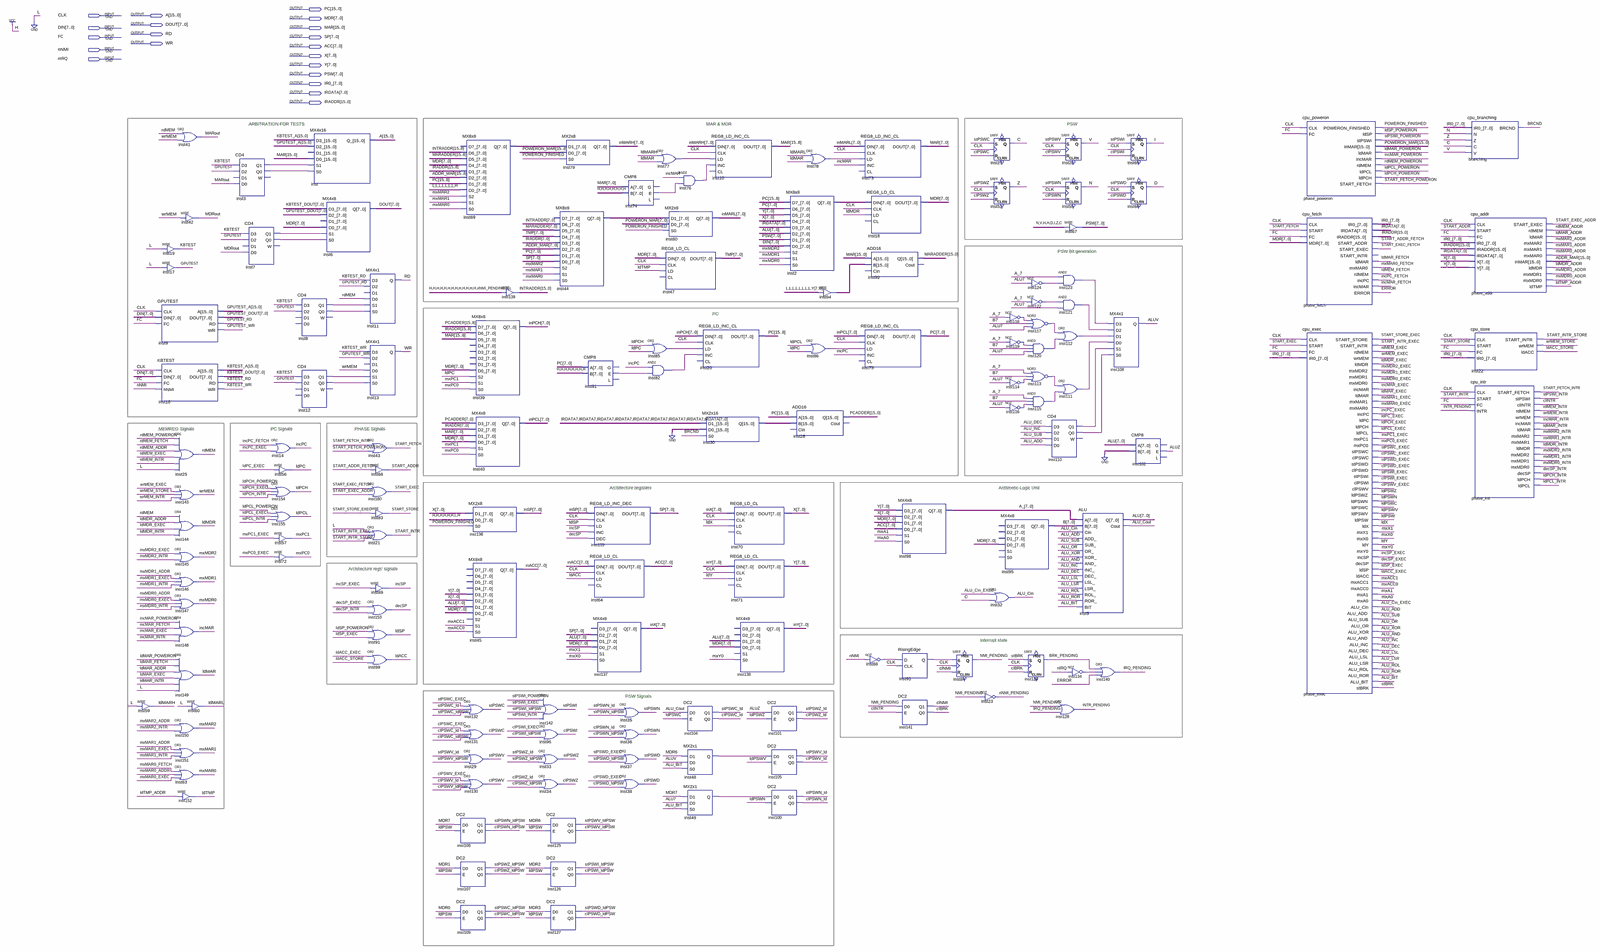
[diagram p0: schematic sheet, whole]
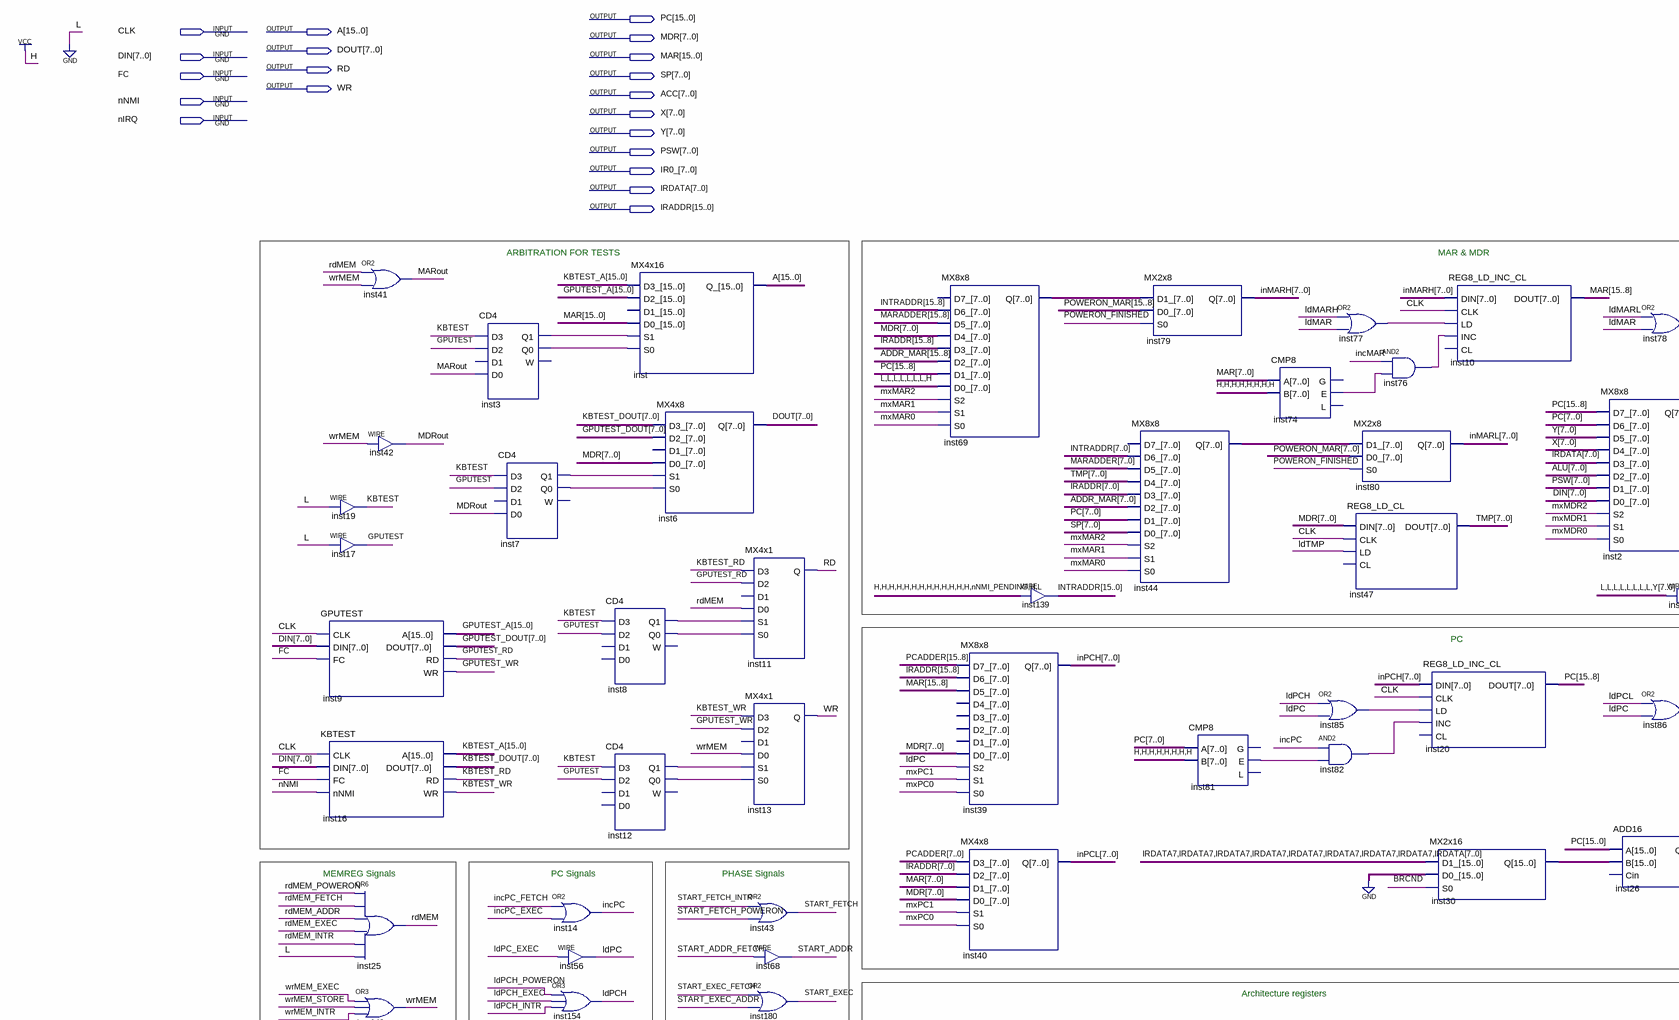
[diagram p1: schematic sheet, upper left part]
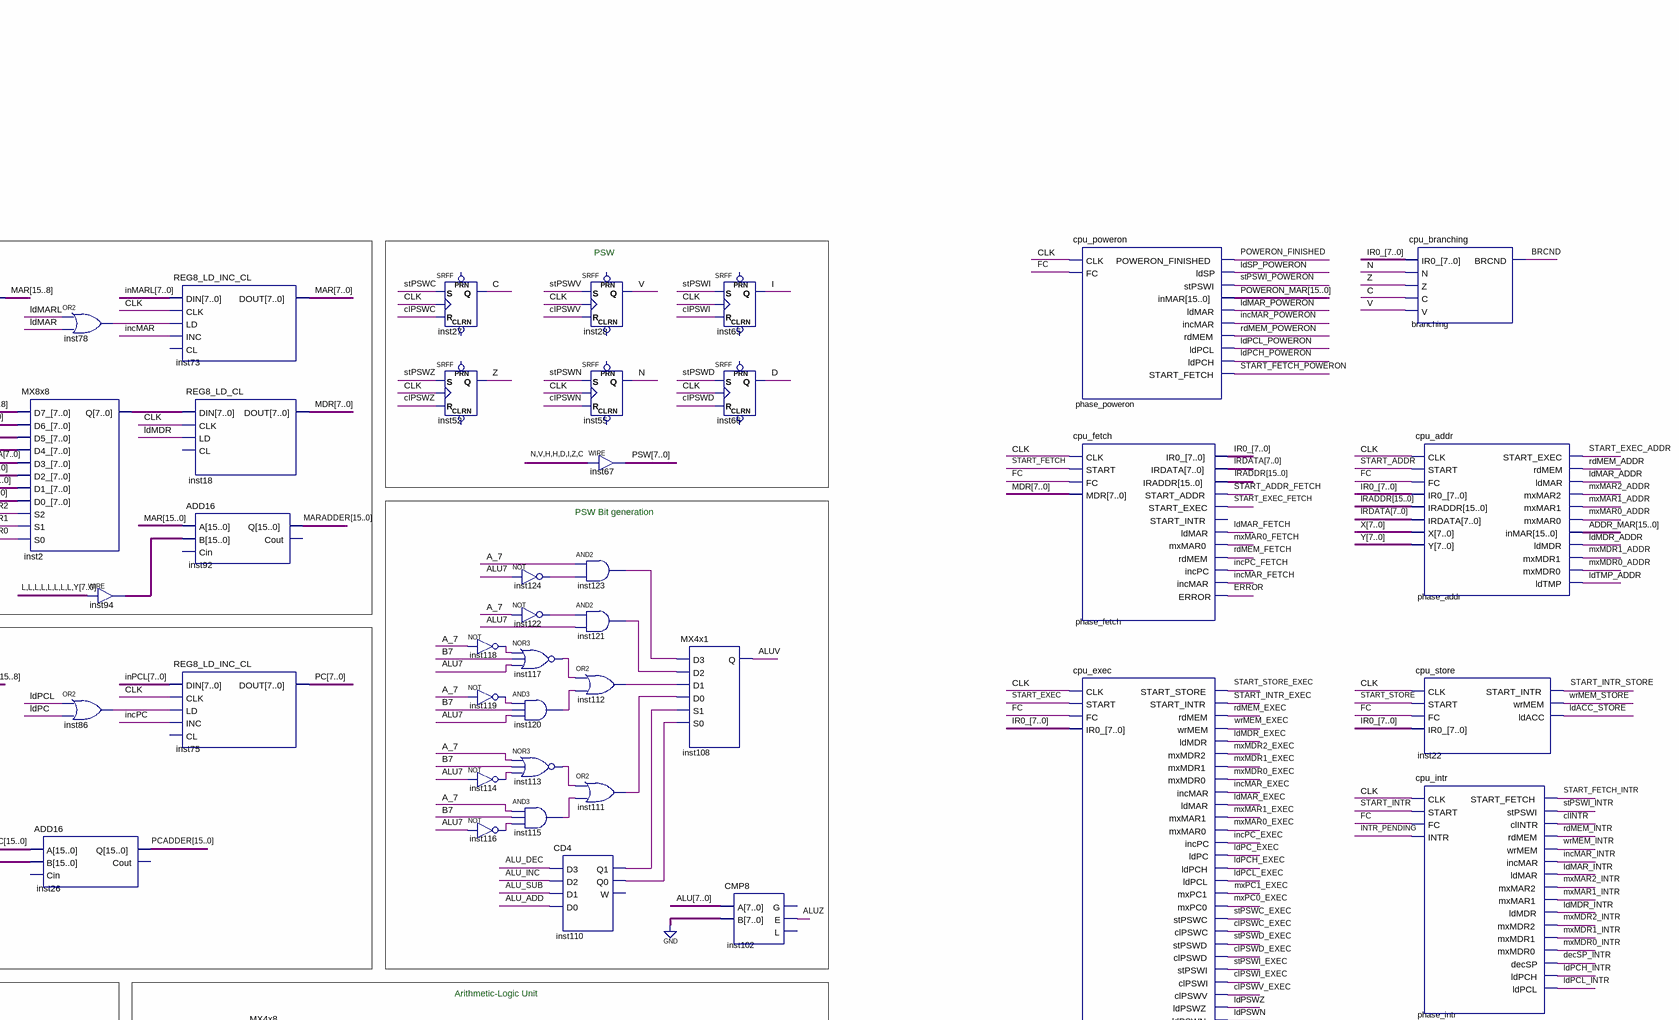
[diagram p2: schematic sheet, upper right part]
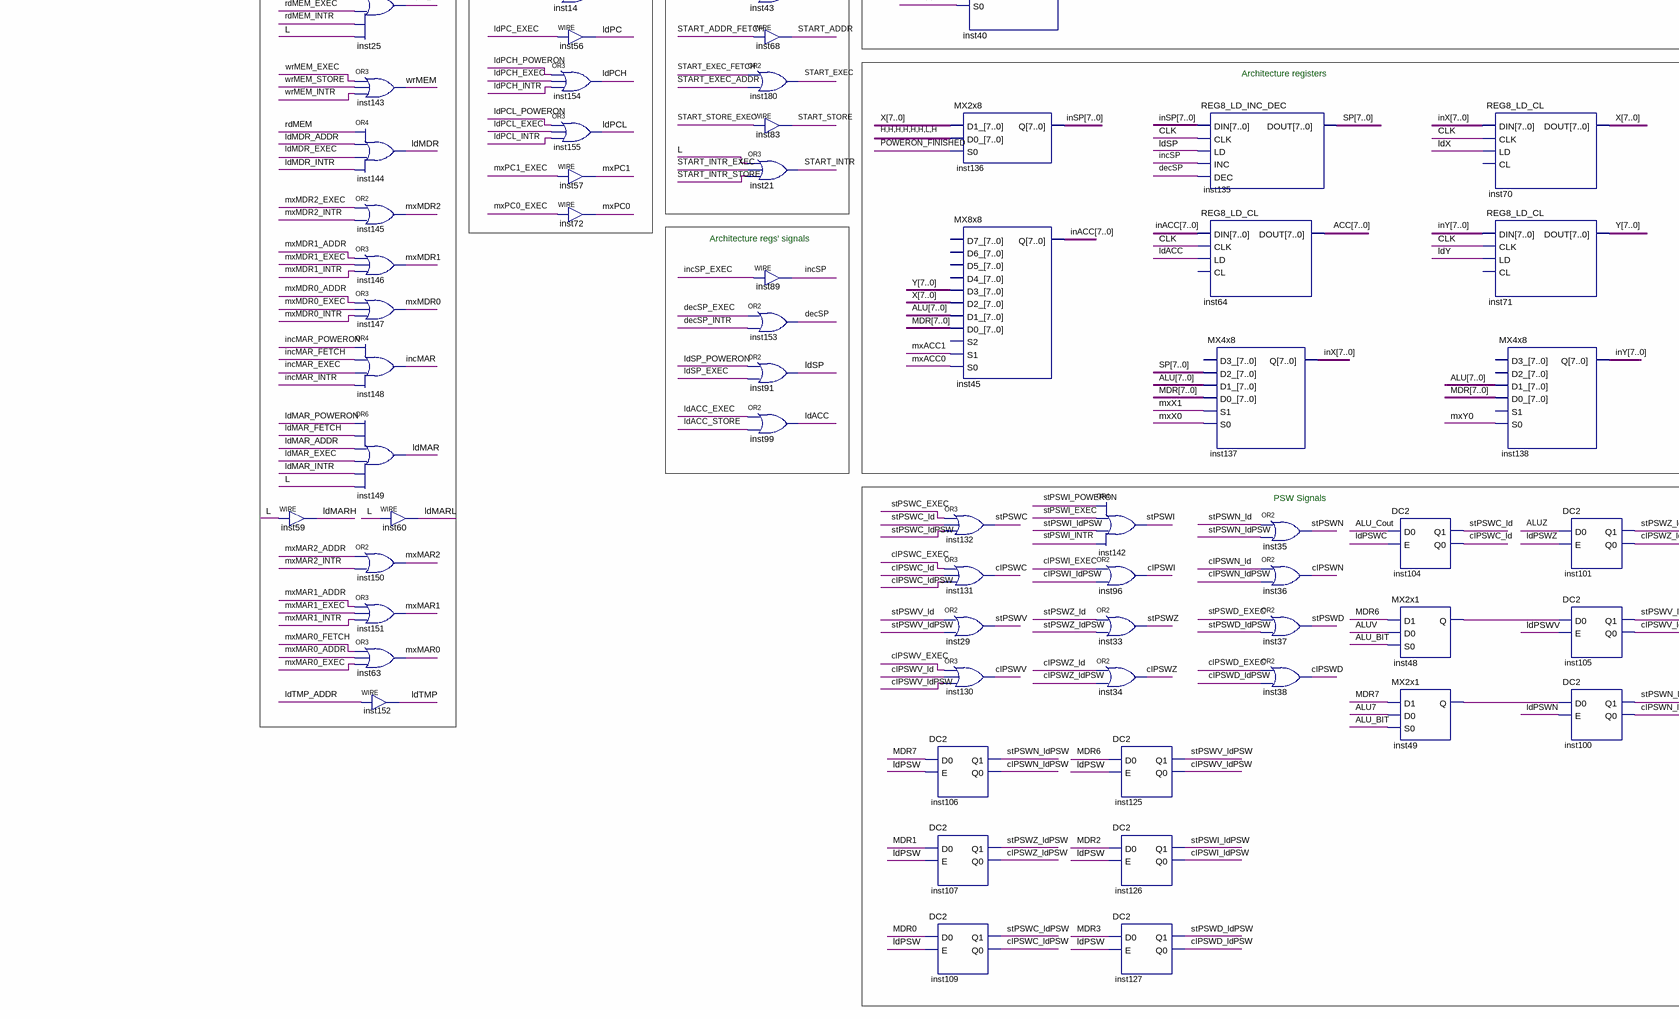
[diagram p3: schematic sheet, lower left part]
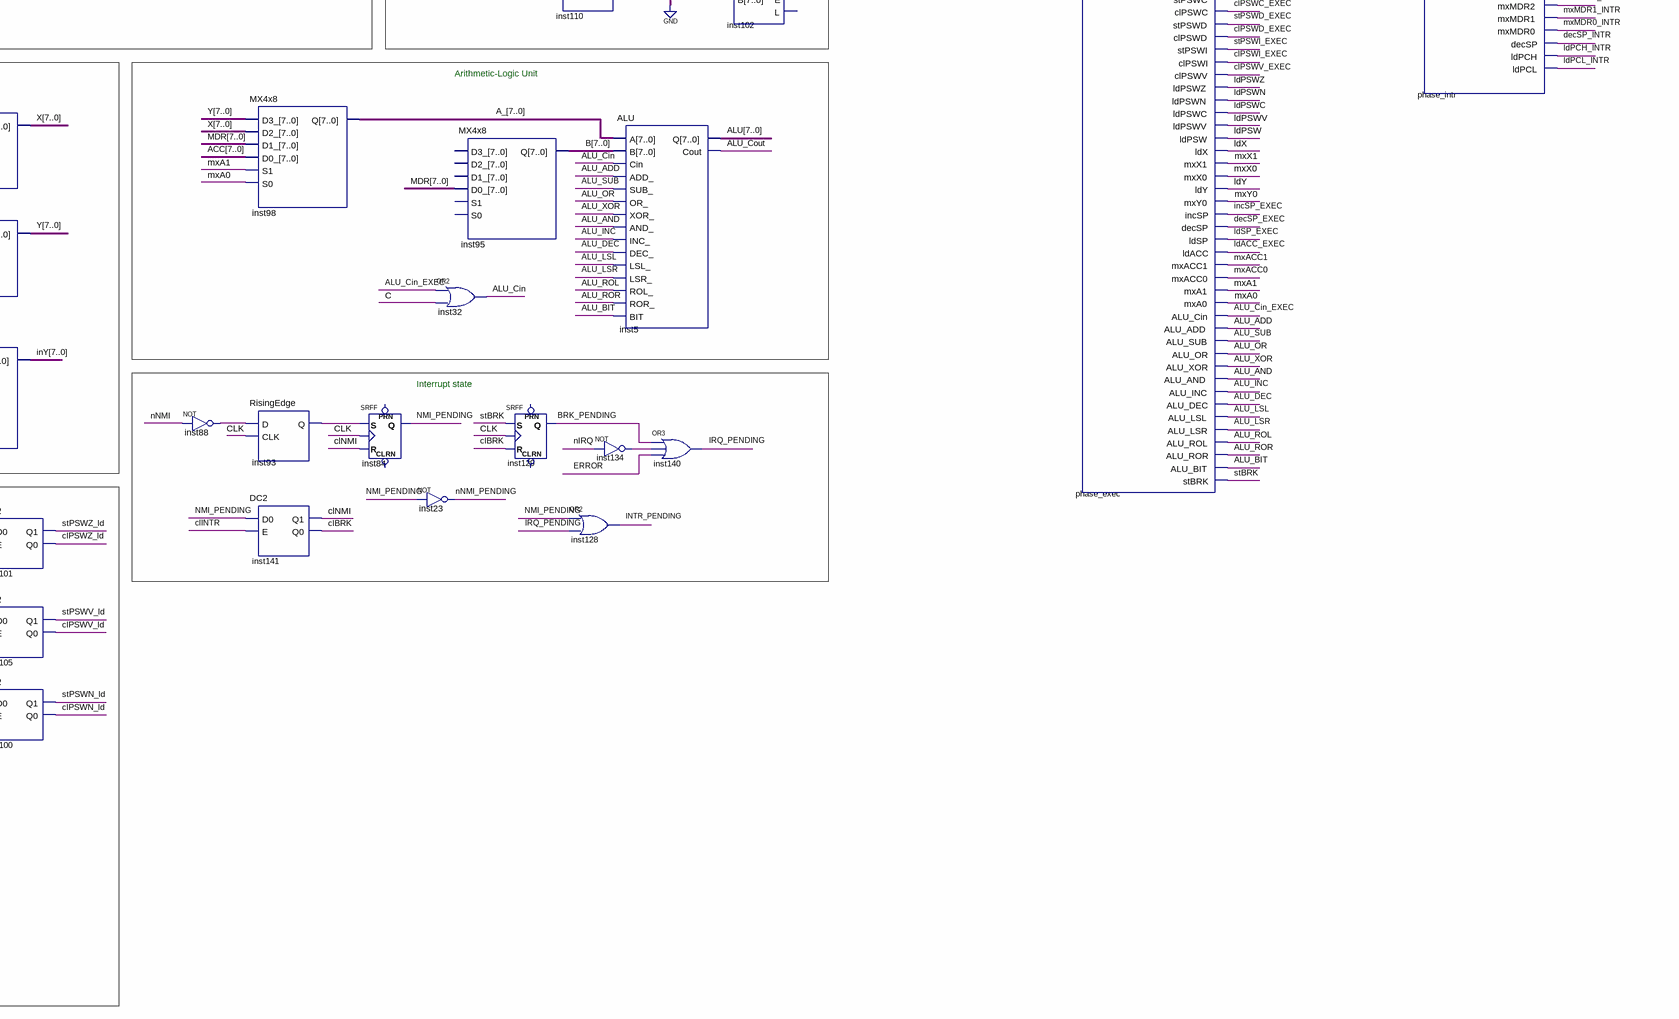
[diagram p4: schematic sheet, lower right part]
// Quartus schematic cpu.bdf as structural Verilog: 145 symbols, 20 pins
module cpu (
  input  CLK,
  input  [7:0] DIN,
  input  FC,
  input  nNMI,
  input  nIRQ,
  output [15:0] PC,
  output [15:0] A,
  output [7:0] MDR,
  output [7:0] DOUT,
  output [15:0] MAR,
  output RD,
  output [7:0] SP,
  output WR,
  output [7:0] ACC,
  output [7:0] X,
  output [7:0] Y,
  output [7:0] PSW,
  output [7:0] IR0_,
  output [7:0] IRDATA,
  output [15:0] IRADDR
);

  wire ALU_ADD, ALU_AND, ALU_BIT, ALU_Cin, ALU_Cin_EXEC, ALU_Cout, ALU_DEC, ALU_INC, ALU_LSL, ALU_LSR,
       ALU_OR, ALU_ROL, ALU_ROR, ALU_SUB, ALU_XOR, ALUV, ALUZ, BRCND, BRK_PENDING, C, clBRK, clINTR, clNMI,
       clPSWC, clPSWC_EXEC, clPSWC_ld, clPSWC_ldPSW, clPSWD, clPSWD_EXEC, clPSWD_ldPSW, clPSWI, clPSWI_EXEC,
       clPSWI_ldPSW, clPSWN, clPSWN_ld, clPSWN_ldPSW, clPSWV, clPSWV_EXEC, clPSWV_ld, clPSWV_ldPSW, clPSWZ,
       clPSWZ_ld, clPSWZ_ldPSW, D, decSP, decSP_EXEC, decSP_INTR, ERROR, GPUTEST, GPUTEST_RD, GPUTEST_WR, I,
       incMAR, incMAR_EXEC, incMAR_FETCH, incMAR_INTR, incMAR_POWERON, incPC, incPC_EXEC, incPC_FETCH, incSP,
       incSP_EXEC, inst3_q0, inst3_q1, inst7_q0, inst7_q1, inst8_q0, inst8_q1, inst12_q0, inst12_q1,
       inst48_q, inst49_q, inst74_e, inst76_out, inst77_out, inst78_out, inst81_e, inst82_out, inst85_out,
       inst86_out, inst88_out, inst93_q, inst110_q0, inst110_q1, inst111_out, inst112_out, inst113_out,
       inst114_out, inst115_out, inst116_out, inst117_out, inst118_out, inst119_out, inst120_out,
       inst121_out, inst122_out, inst123_out, inst124_out, inst134_out, INTR_PENDING, IRQ_PENDING, KBTEST,
       KBTEST_RD, KBTEST_WR, ldACC, ldACC_EXEC, ldACC_STORE, ldMAR, ldMAR_ADDR, ldMAR_EXEC, ldMAR_FETCH,
       ldMAR_INTR, ldMAR_POWERON, ldMARH, ldMARL, ldMDR, ldMDR_ADDR, ldMDR_EXEC, ldMDR_INTR, ldPC, ldPC_EXEC,
       ldPCH, ldPCH_EXEC, ldPCH_INTR, ldPCH_POWERON, ldPCL, ldPCL_EXEC, ldPCL_INTR, ldPCL_POWERON, ldPSW,
       ldPSWC, ldPSWN, ldPSWV, ldPSWZ, ldSP, ldSP_EXEC, ldSP_POWERON, ldTMP, ldTMP_ADDR, ldX, ldY, MARout,
       MDRout, mxA0, mxA1, mxACC0, mxACC1, mxMAR0, mxMAR0_ADDR, mxMAR0_EXEC, mxMAR0_FETCH, mxMAR1,
       mxMAR1_ADDR, mxMAR1_EXEC, mxMAR1_INTR, mxMAR2, mxMAR2_ADDR, mxMAR2_INTR, mxMDR0, mxMDR0_ADDR,
       mxMDR0_EXEC, mxMDR0_INTR, mxMDR1, mxMDR1_ADDR, mxMDR1_EXEC, mxMDR1_INTR, mxMDR2, mxMDR2_EXEC,
       mxMDR2_INTR, mxPC0, mxPC0_EXEC, mxPC1, mxPC1_EXEC, mxX0, mxX1, mxY0, N, NMI_PENDING, nNMI_PENDING,
       POWERON_FINISHED, rdMEM, rdMEM_ADDR, rdMEM_EXEC, rdMEM_FETCH, rdMEM_INTR, rdMEM_POWERON, START_ADDR,
       START_ADDR_FETCH, START_EXEC, START_EXEC_ADDR, START_EXEC_FETCH, START_FETCH, START_FETCH_INTR,
       START_FETCH_POWERON, START_INTR, START_INTR_EXEC, START_INTR_STORE, START_STORE, START_STORE_EXEC,
       stBRK, stPSWC, stPSWC_EXEC, stPSWC_ld, stPSWC_ldPSW, stPSWD, stPSWD_EXEC, stPSWD_ldPSW, stPSWI,
       stPSWI_EXEC, stPSWI_INTR, stPSWI_ldPSW, stPSWI_POWERON, stPSWN, stPSWN_ld, stPSWN_ldPSW, stPSWV,
       stPSWV_ld, stPSWV_ldPSW, stPSWZ, stPSWZ_ld, stPSWZ_ldPSW, V, wrMEM, wrMEM_EXEC, wrMEM_INTR,
       wrMEM_STORE, Z;
  wire [7:0] A_, ALU, B, GPUTEST_DOUT, inACC, inMARH, inMARL, inPCH, inPCL, inSP, inst2_q, inst44_q,
       inst69_q, inX, inY, KBTEST_DOUT, TMP;
  wire [15:0] ADDR_MAR, GPUTEST_A, inst30_q, inst94_out, INTRADDR, KBTEST_A, MARADDER, PCADDER, POWERON_MAR;

  assign ldMARH = 1'b0;  // WIRE inst59
  assign KBTEST = 1'b0;  // WIRE inst19
  assign GPUTEST = 1'b0;  // WIRE inst17
  GPUTEST inst9 (.CLK(CLK), .DIN(DIN), .FC(FC), .A(GPUTEST_A), .DOUT(GPUTEST_DOUT), .RD(GPUTEST_RD), .WR(GPUTEST_WR));
  KBTEST inst16 (
    .CLK(CLK), .DIN(DIN), .FC(FC), .nNMI(nNMI), .A(KBTEST_A), .DOUT(KBTEST_DOUT), .RD(KBTEST_RD),
    .WR(KBTEST_WR));
  or inst41 (MARout, rdMEM, wrMEM);
  assign MDRout = wrMEM;  // WIRE inst42
  or inst25 (rdMEM, rdMEM_POWERON, rdMEM_FETCH, rdMEM_ADDR, rdMEM_EXEC, rdMEM_INTR, 1'b0);
  or inst143 (wrMEM, wrMEM_EXEC, wrMEM_STORE, wrMEM_INTR);
  or inst144 (ldMDR, rdMEM, ldMDR_ADDR, ldMDR_EXEC, ldMDR_INTR);
  or inst145 (mxMDR2, mxMDR2_EXEC, mxMDR2_INTR);
  or inst146 (mxMDR1, mxMDR1_ADDR, mxMDR1_EXEC, mxMDR1_INTR);
  or inst147 (mxMDR0, mxMDR0_ADDR, mxMDR0_EXEC, mxMDR0_INTR);
  or inst148 (incMAR, incMAR_POWERON, incMAR_FETCH, incMAR_EXEC, incMAR_INTR);
  or inst149 (ldMAR, ldMAR_POWERON, ldMAR_FETCH, ldMAR_ADDR, ldMAR_EXEC, ldMAR_INTR, 1'b0);
  assign ldMARL = 1'b0;  // WIRE inst60
  or inst150 (mxMAR2, mxMAR2_ADDR, mxMAR2_INTR);
  or inst151 (mxMAR1, mxMAR1_ADDR, mxMAR1_EXEC, mxMAR1_INTR);
  or inst63 (mxMAR0, mxMAR0_FETCH, mxMAR0_ADDR, mxMAR0_EXEC);
  assign ldTMP = ldTMP_ADDR;  // WIRE inst152
  CD4 inst3 (.D3(KBTEST), .D2(GPUTEST), .D0(MARout), .Q1(inst3_q1), .Q0(inst3_q0));  // open: D1, W
  CD4 inst7 (.D3(KBTEST), .D2(GPUTEST), .D0(MDRout), .Q1(inst7_q1), .Q0(inst7_q0));  // open: D1, W
  or inst14 (incPC, incPC_FETCH, incPC_EXEC);
  assign ldPC = ldPC_EXEC;  // WIRE inst56
  or inst154 (ldPCH, ldPCH_POWERON, ldPCH_EXEC, ldPCH_INTR);
  or inst155 (ldPCL, ldPCL_POWERON, ldPCL_EXEC, ldPCL_INTR);
  assign mxPC1 = mxPC1_EXEC;  // WIRE inst57
  assign mxPC0 = mxPC0_EXEC;  // WIRE inst72
  MX4x16 inst (.D3_(KBTEST_A), .D2_(GPUTEST_A), .D0_(MAR), .S1(inst3_q1), .S0(inst3_q0), .Q_(A));  // open: D1_
  CD4 inst8 (.D3(KBTEST), .D2(GPUTEST), .Q1(inst8_q1), .Q0(inst8_q0));  // open: D1, D0, W
  CD4 inst12 (.D3(KBTEST), .D2(GPUTEST), .Q1(inst12_q1), .Q0(inst12_q0));  // open: D1, D0, W
  MX4x8 inst6 (.D3_(KBTEST_DOUT), .D2_(GPUTEST_DOUT), .D0_(MDR), .S1(inst7_q1), .S0(inst7_q0), .Q(DOUT));  // open: D1_
  MX4x1 inst11 (.D3(KBTEST_RD), .D2(GPUTEST_RD), .D0(rdMEM), .S1(inst8_q1), .S0(inst8_q0), .Q(RD));  // open: D1
  MX4x1 inst13 (.D3(KBTEST_WR), .D2(GPUTEST_WR), .D0(wrMEM), .S1(inst12_q1), .S0(inst12_q0), .Q(WR));  // open: D1
  or inst43 (START_FETCH, START_FETCH_INTR, START_FETCH_POWERON);
  assign START_ADDR = START_ADDR_FETCH;  // WIRE inst68
  or inst180 (START_EXEC, START_EXEC_FETCH, START_EXEC_ADDR);
  assign START_STORE = START_STORE_EXEC;  // WIRE inst83
  or inst21 (START_INTR, 1'b0, START_INTR_EXEC, START_INTR_STORE);
  assign incSP = incSP_EXEC;  // WIRE inst89
  or inst153 (decSP, decSP_EXEC, decSP_INTR);
  or inst91 (ldSP, ldSP_POWERON, ldSP_EXEC);
  or inst99 (ldACC, ldACC_EXEC, ldACC_STORE);
  MX8x8 inst69 (
    .D6_(INTRADDR[15:8]), .D5_(MARADDER[15:8]), .D4_(MDR), .D3_(IRADDR[15:8]), .D2_(ADDR_MAR[15:8]),
    .D1_(PC[15:8]), .D0_(8'b00000001), .S2(mxMAR2), .S1(mxMAR1), .S0(mxMAR0), .Q(inst69_q));  // open: D7_
  DC2 inst106 (.D0(MDR[7]), .E(ldPSW), .Q1(stPSWN_ldPSW), .Q0(clPSWN_ldPSW));
  DC2 inst107 (.D0(MDR[1]), .E(ldPSW), .Q1(stPSWZ_ldPSW), .Q0(clPSWZ_ldPSW));
  DC2 inst109 (.D0(MDR[0]), .E(ldPSW), .Q1(stPSWC_ldPSW), .Q0(clPSWC_ldPSW));
  MX8x8 inst39 (
    .D7_(PCADDER[15:8]), .D6_(IRADDR[15:8]), .D5_(MAR[15:8]), .D0_(MDR), .S2(ldPC), .S1(mxPC1), .S0(mxPC0),
    .Q(inPCH));  // open: D4_, D3_, D2_, D1_
  MX4x8 inst40 (.D3_(PCADDER[7:0]), .D2_(IRADDR[7:0]), .D1_(MAR[7:0]), .D0_(MDR), .S1(mxPC1), .S0(mxPC0), .Q(inPCL));
  MX2x8 inst136 (.D1_(X), .D0_(8'b11111101), .S0(POWERON_FINISHED), .Q(inSP));
  MX8x8 inst45 (
    .D3_(Y), .D2_(X), .D1_(ALU), .D0_(MDR), .S1(mxACC1), .S0(mxACC0), .Q(inACC));  // open: D7_, D6_, D5_, D4_, S2
  or inst132 (stPSWC, stPSWC_EXEC, stPSWC_ld, stPSWC_ldPSW);
  or inst131 (clPSWC, clPSWC_EXEC, clPSWC_ld, clPSWC_ldPSW);
  or inst29 (stPSWV, stPSWV_ld, stPSWV_ldPSW);
  or inst130 (clPSWV, clPSWV_EXEC, clPSWV_ld, clPSWV_ldPSW);
  assign INTRADDR = {{13{1'b1}}, nNMI_PENDING, 2'b10};  // WIRE inst139
  MX2x8 inst79 (.D1_(inst69_q), .D0_(POWERON_MAR[15:8]), .S0(POWERON_FINISHED), .Q(inMARH));
  MX8x8 inst44 (
    .D6_(INTRADDR[7:0]), .D5_(MARADDER[7:0]), .D4_(TMP), .D3_(IRADDR[7:0]), .D2_(ADDR_MAR[7:0]),
    .D1_(PC[7:0]), .D0_(SP), .S2(mxMAR2), .S1(mxMAR1), .S0(mxMAR0), .Q(inst44_q));  // open: D7_
  or inst142 (stPSWI, stPSWI_POWERON, stPSWI_EXEC, stPSWI_ldPSW, stPSWI_INTR);
  or inst96 (clPSWI, clPSWI_EXEC, clPSWI_ldPSW);
  or inst33 (stPSWZ, stPSWZ_ld, stPSWZ_ldPSW);
  or inst34 (clPSWZ, clPSWZ_ld, clPSWZ_ldPSW);
  DC2 inst125 (.D0(MDR[6]), .E(ldPSW), .Q1(stPSWV_ldPSW), .Q0(clPSWV_ldPSW));
  DC2 inst126 (.D0(MDR[2]), .E(ldPSW), .Q1(stPSWI_ldPSW), .Q0(clPSWI_ldPSW));
  DC2 inst127 (.D0(MDR[3]), .E(ldPSW), .Q1(stPSWD_ldPSW), .Q0(clPSWD_ldPSW));
  CMP8 inst81 (.A(PC[7:0]), .B({8{1'b1}}), .E(inst81_e));  // open: G, L
  REG8_LD_INC_DEC inst135 (.DIN(inSP), .CLK(CLK), .LD(ldSP), .INC(incSP), .DEC(decSP), .DOUT(SP));
  REG8_LD_CL inst64 (.DIN(inACC), .CLK(CLK), .LD(ldACC), .DOUT(ACC));  // open: CL
  MX4x8 inst137 (.D2_(SP), .D1_(ALU), .D0_(MDR), .S1(mxX1), .S0(mxX0), .Q(inX));  // open: D3_
  CMP8 inst74 (.A(MAR[7:0]), .B({8{1'b1}}), .E(inst74_e));  // open: G, L
  or inst35 (stPSWN, stPSWN_ld, stPSWN_ldPSW);
  or inst36 (clPSWN, clPSWN_ld, clPSWN_ldPSW);
  or inst37 (stPSWD, stPSWD_EXEC, stPSWD_ldPSW);
  or inst38 (clPSWD, clPSWD_EXEC, clPSWD_ldPSW);
  or inst77 (inst77_out, ldMARH, ldMAR);
  REG8_LD_CL inst47 (.DIN(MDR), .CLK(CLK), .LD(ldTMP), .DOUT(TMP));  // open: CL
  or inst85 (inst85_out, ldPCH, ldPC);
  and inst82 (inst82_out, incPC, inst81_e);
  and inst76 (inst76_out, incMAR, inst74_e);
  MX2x8 inst80 (.D1_(inst44_q), .D0_(POWERON_MAR[7:0]), .S0(POWERON_FINISHED), .Q(inMARL));
  DC2 inst104 (.D0(ALU_Cout), .E(ldPSWC), .Q1(stPSWC_ld), .Q0(clPSWC_ld));
  MX2x1 inst48 (.D1(MDR[6]), .D0(ALUV), .S0(ALU_BIT), .Q(inst48_q));
  MX2x1 inst49 (.D1(MDR[7]), .D0(ALU[7]), .S0(ALU_BIT), .Q(inst49_q));
  REG8_LD_INC_CL inst10 (.DIN(inMARH), .CLK(CLK), .LD(inst77_out), .INC(inst76_out), .DOUT(MAR[15:8]));  // open: CL
  REG8_LD_INC_CL inst20 (.DIN(inPCH), .CLK(CLK), .LD(inst85_out), .INC(inst82_out), .DOUT(PC[15:8]));  // open: CL
  MX2x16 inst30 (.D1_({{9{IRDATA[7]}}, IRDATA[6:0]}), .D0_({16{1'b0}}), .S0(BRCND), .Q(inst30_q));
  REG8_LD_CL inst70 (.DIN(inX), .CLK(CLK), .LD(ldX), .DOUT(X));  // open: CL
  REG8_LD_CL inst71 (.DIN(inY), .CLK(CLK), .LD(ldY), .DOUT(Y));  // open: CL
  MX4x8 inst138 (.D1_(ALU), .D0_(MDR), .S0(mxY0), .Q(inY));  // open: D3_, D2_, S1
  MX8x8 inst2 (
    .D7_(PC[15:8]), .D6_(PC[7:0]), .D5_(Y), .D4_(X), .D3_(IRDATA), .D2_(ALU), .D1_(PSW), .D0_(DIN),
    .S2(mxMDR2), .S1(mxMDR1), .S0(mxMDR0), .Q(inst2_q));
  DC2 inst101 (.D0(ALUZ), .E(ldPSWZ), .Q1(stPSWZ_ld), .Q0(clPSWZ_ld));
  DC2 inst105 (.D0(inst48_q), .E(ldPSWV), .Q1(stPSWV_ld), .Q0(clPSWV_ld));
  DC2 inst100 (.D0(inst49_q), .E(ldPSWN), .Q1(stPSWN_ld), .Q0(clPSWN_ld));
  or inst78 (inst78_out, ldMARL, ldMAR);
  or inst86 (inst86_out, ldPCL, ldPC);
  ADD16 inst26 (.A(PC), .B(inst30_q), .Q(PCADDER));  // open: Cin, Cout
  assign inst94_out = {{8{1'b0}}, Y};  // WIRE inst94
  REG8_LD_INC_CL inst73 (.DIN(inMARL), .CLK(CLK), .LD(inst78_out), .INC(incMAR), .DOUT(MAR[7:0]));  // open: CL
  REG8_LD_INC_CL inst75 (.DIN(inPCL), .CLK(CLK), .LD(inst86_out), .INC(incPC), .DOUT(PC[7:0]));  // open: CL
  REG8_LD_CL inst18 (.DIN(inst2_q), .CLK(CLK), .LD(ldMDR), .DOUT(MDR));  // open: CL
  ADD16 inst92 (.A(MAR), .B(inst94_out), .Q(MARADDER));  // open: Cin, Cout
  not inst88 (inst88_out, nNMI);
  MX4x8 inst98 (.D3_(Y), .D2_(X), .D1_(MDR), .D0_(ACC), .S1(mxA1), .S0(mxA0), .Q(A_));
  RisingEdge inst93 (.D(inst88_out), .CLK(CLK), .Q(inst93_q));
  DC2 inst141 (.D0(NMI_PENDING), .E(clINTR), .Q1(clNMI), .Q0(clBRK));
  SRFF inst84 (.S(inst93_q), .R(clNMI), .CLK(CLK), .Q(NMI_PENDING));  // open: PRN, CLRN
  not inst23 (nNMI_PENDING, NMI_PENDING);
  SRFF inst27 (.S(stPSWC), .R(clPSWC), .CLK(CLK), .Q(C));  // open: PRN, CLRN
  SRFF inst52 (.S(stPSWZ), .R(clPSWZ), .CLK(CLK), .Q(Z));  // open: PRN, CLRN
  not inst118 (inst118_out, A_[7]);
  not inst119 (inst119_out, A_[7]);
  not inst114 (inst114_out, ALU[7]);
  not inst116 (inst116_out, ALU[7]);
  MX4x8 inst95 (.D0_(MDR), .Q(B));  // open: D3_, D2_, D1_, S1, S0
  or inst32 (ALU_Cin, ALU_Cin_EXEC, C);
  not inst124 (inst124_out, ALU[7]);
  not inst122 (inst122_out, A_[7]);
  nor inst117 (inst117_out, inst118_out, B[7], ALU[7]);
  and inst120 (inst120_out, inst119_out, B[7], ALU[7]);
  nor inst113 (inst113_out, A_[7], B[7], inst114_out);
  and inst115 (inst115_out, A_[7], B[7], inst116_out);
  SRFF inst129 (.S(stBRK), .R(clBRK), .CLK(CLK), .Q(BRK_PENDING));  // open: PRN, CLRN
  and inst123 (inst123_out, A_[7], inst124_out);
  and inst121 (inst121_out, inst122_out, ALU[7]);
  or inst112 (inst112_out, inst117_out, inst120_out);
  or inst111 (inst111_out, inst113_out, inst115_out);
  CD4 inst110 (.D3(ALU_DEC), .D2(ALU_INC), .D1(ALU_SUB), .D0(ALU_ADD), .Q1(inst110_q1), .Q0(inst110_q0));  // open: W
  or inst128 (INTR_PENDING, NMI_PENDING, IRQ_PENDING);
  SRFF inst28 (.S(stPSWV), .R(clPSWV), .CLK(CLK), .Q(V));  // open: PRN, CLRN
  SRFF inst55 (.S(stPSWN), .R(clPSWN), .CLK(CLK), .Q(N));  // open: PRN, CLRN
  assign PSW = {N, V, 2'b11, D, I, Z, C};  // WIRE inst67
  ALU inst5 (
    .A(A_), .B(B), .Cin(ALU_Cin), .ADD_(ALU_ADD), .SUB_(ALU_SUB), .OR_(ALU_OR), .XOR_(ALU_XOR),
    .AND_(ALU_AND), .INC_(ALU_INC), .DEC_(ALU_DEC), .LSL_(ALU_LSL), .LSR_(ALU_LSR), .ROL_(ALU_ROL),
    .ROR_(ALU_ROR), .BIT(ALU_BIT), .Q(ALU), .Cout(ALU_Cout));
  not inst134 (inst134_out, nIRQ);
  MX4x1 inst108 (
    .D3(inst123_out), .D2(inst121_out), .D1(inst112_out), .D0(inst111_out), .S1(inst110_q1), .S0(inst110_q0),
    .Q(ALUV));
  or inst140 (IRQ_PENDING, BRK_PENDING, inst134_out, ERROR);
  SRFF inst65 (.S(stPSWI), .R(clPSWI), .CLK(CLK), .Q(I));  // open: PRN, CLRN
  SRFF inst66 (.S(stPSWD), .R(clPSWD), .CLK(CLK), .Q(D));  // open: PRN, CLRN
  CMP8 inst102 (.A(ALU), .B({8{1'b0}}), .E(ALUZ));  // open: G, L
  cpu_poweron phase_poweron (
    .CLK(CLK), .FC(FC), .POWERON_FINISHED(POWERON_FINISHED), .ldSP(ldSP_POWERON), .stPSWI(stPSWI_POWERON),
    .inMAR(POWERON_MAR), .ldMAR(ldMAR_POWERON), .incMAR(incMAR_POWERON), .rdMEM(rdMEM_POWERON),
    .ldPCL(ldPCL_POWERON), .ldPCH(ldPCH_POWERON), .START_FETCH(START_FETCH_POWERON));
  cpu_fetch phase_fetch (
    .CLK(CLK), .START(START_FETCH), .FC(FC), .MDR(MDR), .IR0_(IR0_), .IRDATA(IRDATA), .IRADDR(IRADDR),
    .START_ADDR(START_ADDR_FETCH), .START_EXEC(START_EXEC_FETCH), .ldMAR(ldMAR_FETCH), .mxMAR0(mxMAR0_FETCH),
    .rdMEM(rdMEM_FETCH), .incPC(incPC_FETCH), .incMAR(incMAR_FETCH), .ERROR(ERROR));  // open: START_INTR
  cpu_exec phase_exec (
    .CLK(CLK), .START(START_EXEC), .FC(FC), .IR0_(IR0_), .START_STORE(START_STORE_EXEC),
    .START_INTR(START_INTR_EXEC), .rdMEM(rdMEM_EXEC), .wrMEM(wrMEM_EXEC), .ldMDR(ldMDR_EXEC),
    .mxMDR2(mxMDR2_EXEC), .mxMDR1(mxMDR1_EXEC), .mxMDR0(mxMDR0_EXEC), .incMAR(incMAR_EXEC),
    .ldMAR(ldMAR_EXEC), .mxMAR1(mxMAR1_EXEC), .mxMAR0(mxMAR0_EXEC), .incPC(incPC_EXEC), .ldPC(ldPC_EXEC),
    .ldPCH(ldPCH_EXEC), .ldPCL(ldPCL_EXEC), .mxPC1(mxPC1_EXEC), .mxPC0(mxPC0_EXEC), .stPSWC(stPSWC_EXEC),
    .clPSWC(clPSWC_EXEC), .stPSWD(stPSWD_EXEC), .clPSWD(clPSWD_EXEC), .stPSWI(stPSWI_EXEC),
    .clPSWI(clPSWI_EXEC), .clPSWV(clPSWV_EXEC), .ldPSWZ(ldPSWZ), .ldPSWN(ldPSWN), .ldPSWC(ldPSWC),
    .ldPSWV(ldPSWV), .ldPSW(ldPSW), .ldX(ldX), .mxX1(mxX1), .mxX0(mxX0), .ldY(ldY), .mxY0(mxY0),
    .incSP(incSP_EXEC), .decSP(decSP_EXEC), .ldSP(ldSP_EXEC), .ldACC(ldACC_EXEC), .mxACC1(mxACC1),
    .mxACC0(mxACC0), .mxA1(mxA1), .mxA0(mxA0), .ALU_Cin(ALU_Cin_EXEC), .ALU_ADD(ALU_ADD), .ALU_SUB(ALU_SUB),
    .ALU_OR(ALU_OR), .ALU_XOR(ALU_XOR), .ALU_AND(ALU_AND), .ALU_INC(ALU_INC), .ALU_DEC(ALU_DEC),
    .ALU_LSL(ALU_LSL), .ALU_LSR(ALU_LSR), .ALU_ROL(ALU_ROL), .ALU_ROR(ALU_ROR), .ALU_BIT(ALU_BIT),
    .stBRK(stBRK));
  cpu_branching branching (.IR0_(IR0_), .N(N), .Z(Z), .C(C), .V(V), .BRCND(BRCND));
  cpu_addr phase_addr (
    .CLK(CLK), .START(START_ADDR), .FC(FC), .IR0_(IR0_), .IRADDR(IRADDR), .IRDATA(IRDATA), .X(X), .Y(Y),
    .START_EXEC(START_EXEC_ADDR), .rdMEM(rdMEM_ADDR), .ldMAR(ldMAR_ADDR), .mxMAR2(mxMAR2_ADDR),
    .mxMAR1(mxMAR1_ADDR), .mxMAR0(mxMAR0_ADDR), .inMAR(ADDR_MAR), .ldMDR(ldMDR_ADDR), .mxMDR1(mxMDR1_ADDR),
    .mxMDR0(mxMDR0_ADDR), .ldTMP(ldTMP_ADDR));
  cpu_store inst22 (
    .CLK(CLK), .START(START_STORE), .FC(FC), .IR0_(IR0_), .START_INTR(START_INTR_STORE), .wrMEM(wrMEM_STORE),
    .ldACC(ldACC_STORE));
  cpu_intr phase_intr (
    .CLK(CLK), .START(START_INTR), .FC(FC), .INTR(INTR_PENDING), .START_FETCH(START_FETCH_INTR),
    .stPSWI(stPSWI_INTR), .clINTR(clINTR), .rdMEM(rdMEM_INTR), .wrMEM(wrMEM_INTR), .incMAR(incMAR_INTR),
    .ldMAR(ldMAR_INTR), .mxMAR2(mxMAR2_INTR), .mxMAR1(mxMAR1_INTR), .ldMDR(ldMDR_INTR), .mxMDR2(mxMDR2_INTR),
    .mxMDR1(mxMDR1_INTR), .mxMDR0(mxMDR0_INTR), .decSP(decSP_INTR), .ldPCH(ldPCH_INTR), .ldPCL(ldPCL_INTR));

  // Notes on the sheet:
  //   ARBITRATION FOR TESTS
  //   MAR & MDR
  //   PSW
  //   PSW Bit generation
  //   PC
  //   MEMREG Signals
  //   PC Signals
  //   PHASE Signals
  //   Architecture registers
  //   Arithmetic-Logic Unit
  //   Architecture regs' signals
  //   Interrupt state
  //   PSW Signals
endmodule
